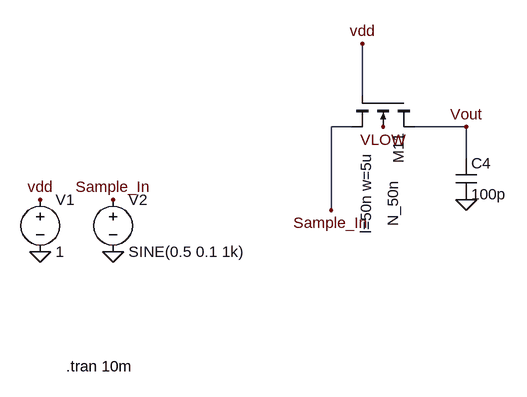
[diagram p0: schematic sample_hold_passGate.asc]
sample_hold_passGate.asc, the LTspice schematic file:
Version 4
SHEET 1 2864 680
WIRE 1856 -592 1856 -672
WIRE 1840 -544 1808 -544
WIRE 2016 -544 1936 -544
WIRE 2016 -496 2016 -544
WIRE 1808 -416 1808 -544
FLAG 2016 -544 Vout
FLAG 1888 -544 VLOW
FLAG 1808 -416 Sample_In
FLAG 2016 -432 0
FLAG 1360 -352 0
FLAG 1472 -352 0
FLAG 1360 -432 vdd
FLAG 1856 -672 vdd
FLAG 1472 -432 Sample_In
SYMBOL nmos4 1936 -592 R90
WINDOW 0 104 24 Right 2
WINDOW 3 201 33 Right 2
WINDOW 123 213 74 Right 2
SYMATTR InstName M11
SYMATTR Value N_50n
SYMATTR Value2 l=50n w=5u
SYMBOL cap 2000 -496 R0
SYMATTR InstName C4
SYMATTR Value 100p
SYMBOL voltage 1360 -448 R0
WINDOW 123 0 0 Left 0
WINDOW 39 0 0 Left 0
SYMATTR InstName V1
SYMATTR Value 1
SYMBOL voltage 1472 -448 R0
WINDOW 123 0 0 Left 0
WINDOW 39 0 0 Left 0
SYMATTR InstName V2
SYMATTR Value SINE(0.5 0.1 1k)
TEXT 1400 -176 Left 2 !.tran 10m

The netlist it stands for:
* sample_hold_passGate.asc
M11 Vout vdd Sample_In VLOW N_50n l=50n w=5u
C4 Vout 0 100p
V1 vdd 0 1
V2 Sample_In 0 SINE(0.5 0.1 1k)
.model NMOS NMOS
.model PMOS PMOS
.lib standard.mos
.tran 10m
.backanno
.end